# EAGLE schematic Schema_FoxDigi (EAGLE 9.0.1)
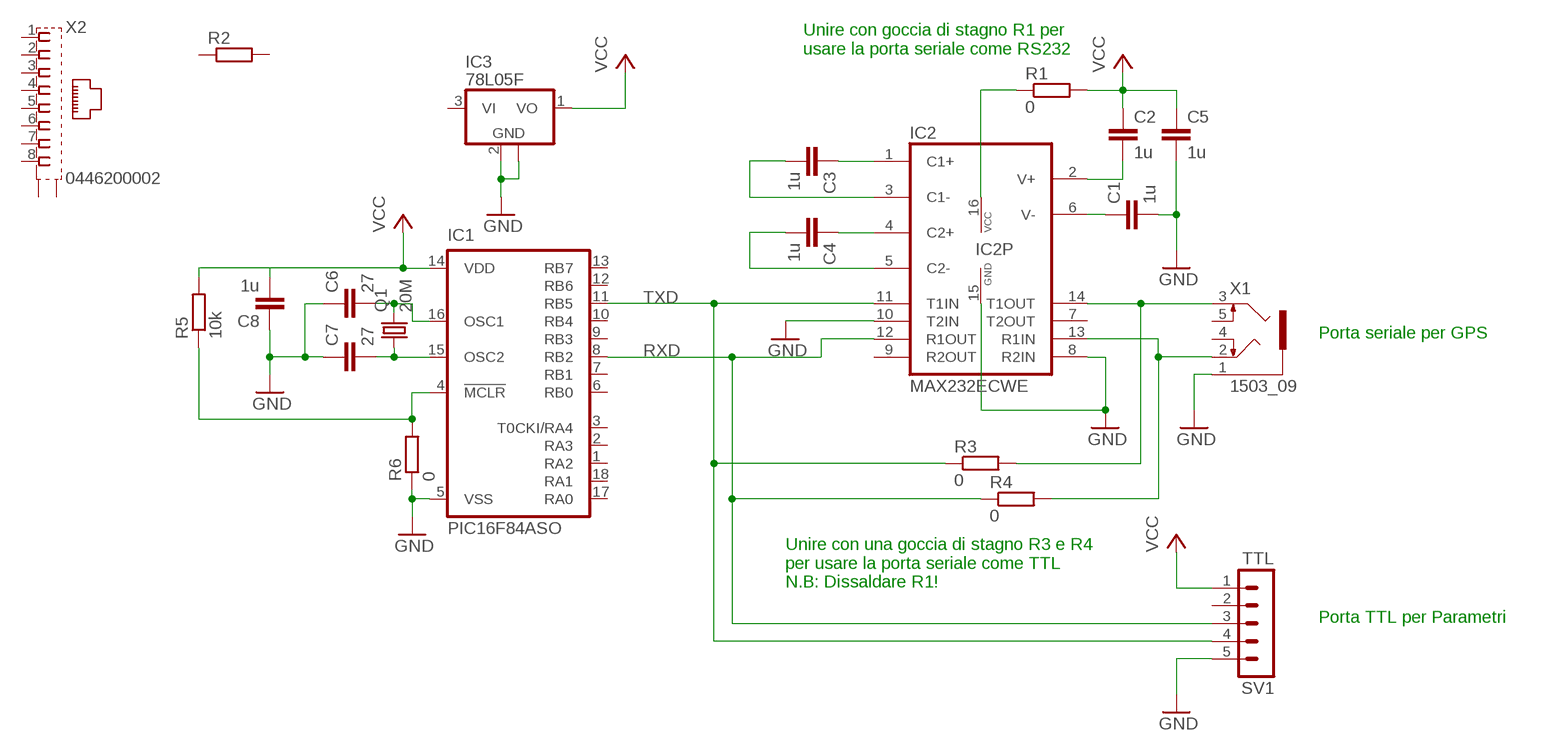
[diagram p0: schematic, sheet 1]

## Parts
C1  1u  C-EUC1206  [C1206]
C2  1u  C-EUC1206  [C1206]
C3  1u  C-EUC1206  [C1206]
C4  1u  C-EUC1206  [C1206]
C5  1u  C-EUC1206  [C1206]
C6  27  C-EU025-025X050  [C025-025X050]
C7  27  C-EU025-025X050  [C025-025X050]
C8  1u  C-EUC1206  [C1206]
IC1  PIC16F84ASO  [SO-18W]
IC2  MAX232ECWE  [SO16L]
IC3  78L05F  [SOT89]
Q1  20M  CRYSTALHC49S  [HC49/S]
R1  0  R-EU_M1206  [M1206]
R2  R-EU_M1206  [M1206]
R3  0  R-EU_M1206  [M1206]
R4  0  R-EU_M1206  [M1206]
R5  10k  R-EU_M1206  [M1206]
R6  0  R-EU_M1206  [M1206]
SV1  TTL  MA05-1  [MA05-1]
X1  1503_09  [1503_09]
X2  0446200002  [0446200002]

## Nets
GND: C1.2 C5.2 C6.1 C7.1 C8.1 IC1.5(VSS) IC2.8(R2IN) IC2.10(T2IN) IC2.15(GND) IC3.2(GND) IC3.2@1(GND) R6.1 SV1.5 X1.1
N$1: C4.2 IC2.5(C2-)
N$2: IC2.13(R1IN) R4.2 X1.2
N$3: IC2.14(T1OUT) R3.2 X1.3
N$6: C3.1 IC2.1(C1+)
N$7: C2.2 IC2.2(V+)
N$8: C4.1 IC2.4(C2+)
N$9: C1.1 IC2.6(V-)
N$10: C3.2 IC2.3(C1-)
N$11: C6.2 IC1.16(OSC1) Q1.2
N$12: C7.2 IC1.15(OSC2) Q1.1
N$13: IC1.4(!MCLR) R5.1 R6.2
N$19: IC2.16(VCC) R1.1
RXD: IC1.8(RB2) IC2.12(R1OUT) R4.1 SV1.3
TXD: IC1.11(RB5) IC2.11(T1IN) R3.1 SV1.4
VCC: C2.1 C5.1 C8.2 IC1.14(VDD) IC3.1(VO) R1.2 R5.2 SV1.1
Unconnected: IC1.1(RA2) IC1.2(RA3) IC1.3(T0CKI/RA4) IC1.6(RB0) IC1.7(RB1) IC1.9(RB3) IC1.10(RB4) IC1.12(RB6) IC1.13(RB7) IC1.17(RA0) IC1.18(RA1) IC2.7(T2OUT) IC2.9(R2OUT) IC3.3(VI) R2.1 R2.2 SV1.2 X1.4 X1.5 X2.1 X2.2 X2.3 X2.4 X2.5 X2.6 X2.7 X2.8 X2.S@1(S1) X2.S@2(S2)

## Notes on the sheet
- Unire con goccia di stagno R1 per
  usare la porta seriale come RS232
- Porta seriale per GPS
- Unire con una goccia di stagno R3 e R4
  per usare la porta seriale come TTL
  N.B: Dissaldare R1!
- Porta TTL per Parametri

## Library data of the parts
C1-C8 = rcl:C-EU: CAPACITOR, European symbol; SPICEPREFIX: C
IC1 = microchip:PIC16F8*: MICROCONTROLLER 8-Bit PIC16F8X Family - CMOS Flash/EEPROM Pin Compatible : PIC16F83, PIC16CR83, PIC16F84A, PIC16CR84 see also PIC16C* <DEVICE:PIC16C*>; MF: MICROCHIP; MPN: PIC16F84A-04/SO; OC_FARNELL: 9760890; OC_NEWARK: 69K7634
IC2 = maxim:MAX232ECWE: RS232 TRANSCEIVER; MF: MAXIM; MPN: MAX232ECWE+; OC_FARNELL: 9724435; OC_NEWARK: 67K4440
IC3 = linear:78L*: POSITOIV-VOLTAGE REGULATORS Output up to 100 mA Source: Datasheet <http://focus.ti.com/lit/ds/symlink/ua78l05.pdf>
Q1 = crystal:CRYSTAL: CRYSTAL; OC_FARNELL: 1667008; OC_NEWARK: unknown
R1-R6 = resistor:R-EU_: RESISTOR, European symbol
SV1 = con-lstb:MA05-1: PIN HEADER; OC_FARNELL: unknown; OC_NEWARK: unknown
X1 = con-lumberg:1503_09: Jack connectors according to JISC 6560, 3.5 mm Klinkeneinbaukupplung nach JISC 6560, 3,5 mm, 3-polig/ stereo, abgewinkelte Ausführung, mit 2 Öffnern und Lötaugen, für Leiterplatten Rückseitenmontage Source: http://www.lumberg.com/Produkte/PDFs/1503_09.pdf; OC_FARNELL: 1243244; OC_NEWARK: unknown
X2 = con-molex:0446200002: RJ-45 INVERTED MODULAR JACK ASSEMBLY WITH RJ-11 KEEPOUT FEATURE Source: Data sheet <http://www.farnell.com/datasheets/73207.pdf> MOLEX 0446200002 BUCHSE, RJ45, GESCHIRMT Source: Farnell <http://de.farnell.com/molex/0446200002/buchse-rj45-geschirmt/dp/9251910?ost=9251910>; MF: MOLEX; MPN: 0446200002; OC_FARNELL: 9251910